# Altium schematic sheet Temperature.SchDoc
size A
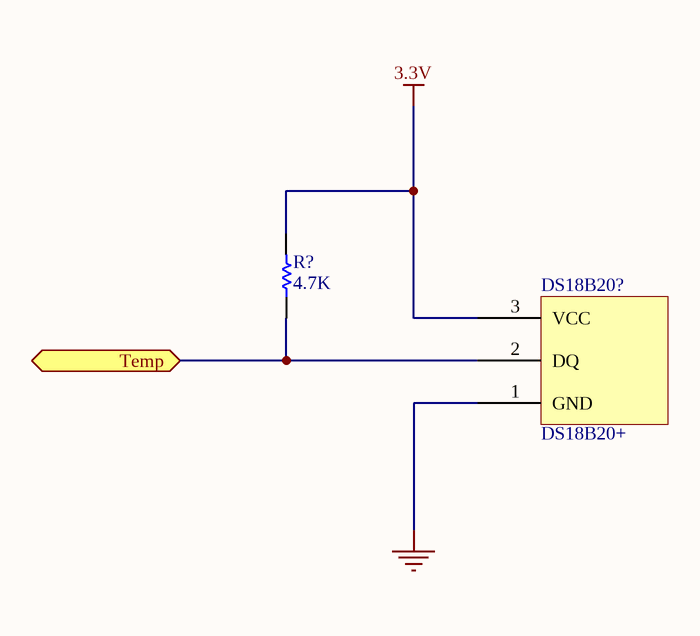
[diagram p0: Temperature.SchDoc]

## Parts
DS18B20?  DS18B20+
R?  4.7K  [AXIAL-0.3]

## Ports
Temp (bidir)

## Nets
3.3V: DS18B20?.3(VCC) R?.2
GND: DS18B20?.1(GND)
Temp: DS18B20?.2(DQ) R?.1 ; port Temp

## Library data of the parts
R? = Res1: Resistor; Value: 1K; Published: 8-Jun-2000; LatestRevisionDate: 17-Jul-2002; LatestRevisionNote: Re-released for DXP Platform.; PackageReference: AXIAL-0.3; Publisher: Altium Limited; PackageDescription: Axial Device, Thru-Hole; 2 Leads; 0.3 in Pin Spacing